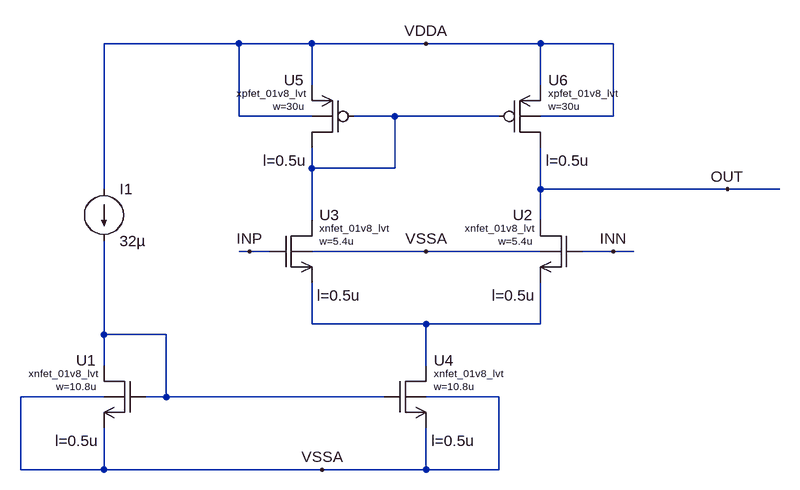
[diagram p0: schematic OTA5N_2p_20MHz.asc]
OTA5N_2p_20MHz.asc, the LTspice schematic file:
Version 4.1
SHEET 1 1108 832
WIRE 144 128 -64 128
WIRE 256 128 144 128
WIRE 432 128 256 128
WIRE 608 128 432 128
WIRE 720 128 608 128
WIRE 256 192 256 128
WIRE 608 192 608 128
WIRE 144 240 144 128
WIRE 256 240 144 240
WIRE 384 240 320 240
WIRE 544 240 384 240
WIRE 720 240 720 128
WIRE 720 240 608 240
WIRE 256 320 256 288
WIRE 384 320 384 240
WIRE 384 320 256 320
WIRE -64 352 -64 128
WIRE 608 352 608 288
WIRE 896 352 608 352
WIRE 976 352 896 352
WIRE 256 400 256 320
WIRE 608 400 608 352
WIRE 160 448 144 448
WIRE 192 448 160 448
WIRE 432 448 256 448
WIRE 608 448 432 448
WIRE 720 448 672 448
WIRE 752 448 720 448
WIRE 256 560 256 496
WIRE 432 560 256 560
WIRE 608 560 608 496
WIRE 608 560 432 560
WIRE -64 576 -64 432
WIRE 32 576 -64 576
WIRE -64 624 -64 576
WIRE 432 624 432 560
WIRE -64 672 -192 672
WIRE 32 672 32 576
WIRE 32 672 0 672
WIRE 368 672 32 672
WIRE 544 672 432 672
WIRE -192 784 -192 672
WIRE -64 784 -64 720
WIRE -64 784 -192 784
WIRE 272 784 -64 784
WIRE 432 784 432 720
WIRE 432 784 272 784
WIRE 544 784 544 672
WIRE 544 784 432 784
FLAG 720 448 INN
FLAG 160 448 INP
FLAG 896 352 OUT
FLAG 432 128 VDDA
FLAG 272 784 VSSA
FLAG 432 448 VSSA
SYMBOL current -64 352 R0
WINDOW 123 0 0 Left 0
WINDOW 39 0 0 Left 0
SYMATTR InstName I1
SYMATTR Value 32µ
SYMBOL xnch -16 624 M0
WINDOW 123 56 116 Left 2
SYMATTR Value2 l=0.5u
SYMATTR InstName U1
SYMATTR Value w=10.8u
SYMATTR SpiceModel xnfet_01v8_lvt
SYMBOL xnch 656 400 M0
WINDOW 123 56 116 Left 2
SYMATTR Value2 l=0.5u
SYMATTR InstName U2
SYMATTR Value w=5.4u
SYMATTR SpiceModel xnfet_01v8_lvt
SYMBOL xnch 208 400 R0
WINDOW 123 56 116 Left 2
SYMATTR Value2 l=0.5u
SYMATTR InstName U3
SYMATTR Value w=5.4u
SYMATTR SpiceModel xnfet_01v8_lvt
SYMBOL xnch 384 624 R0
WINDOW 123 56 116 Left 2
SYMATTR Value2 l=0.5u
SYMATTR InstName U4
SYMATTR Value w=10.8u
SYMATTR SpiceModel xnfet_01v8_lvt
SYMBOL xpch 304 192 M0
WINDOW 123 56 116 Left 2
SYMATTR Value2 l=0.5u
SYMATTR InstName U5
SYMATTR Value w=30u
SYMATTR SpiceModel xpfet_01v8_lvt
SYMBOL xpch 560 192 R0
WINDOW 123 56 116 Left 2
SYMATTR Value2 l=0.5u
SYMATTR InstName U6
SYMATTR Value w=30u
SYMATTR SpiceModel xpfet_01v8_lvt

The netlist it stands for:
* OTA5N_2p_20MHz.asc
I1 VDDA N003 32µ
X§U1 N003 N003 VSSA VSSA xnfet_01v8_lvt w=10.8u l=0.5u  ; pins D G S B
X§U2 OUT INN N002 VSSA xnfet_01v8_lvt w=5.4u l=0.5u  ; pins D G S B
X§U3 N001 INP N002 VSSA xnfet_01v8_lvt w=5.4u l=0.5u  ; pins D G S B
X§U4 N002 N003 VSSA VSSA xnfet_01v8_lvt w=10.8u l=0.5u  ; pins D G S B
X§U5 N001 N001 VDDA VDDA xpfet_01v8_lvt w=30u l=0.5u  ; pins D G S B
X§U6 OUT N001 VDDA VDDA xpfet_01v8_lvt w=30u l=0.5u  ; pins D G S B
.backanno
.end